# Altium schematic sheet LIDO-HW.200.MCU_SWD_Reset.SchDoc
size A3; SheetNumber: 12; SheetTotal: 17
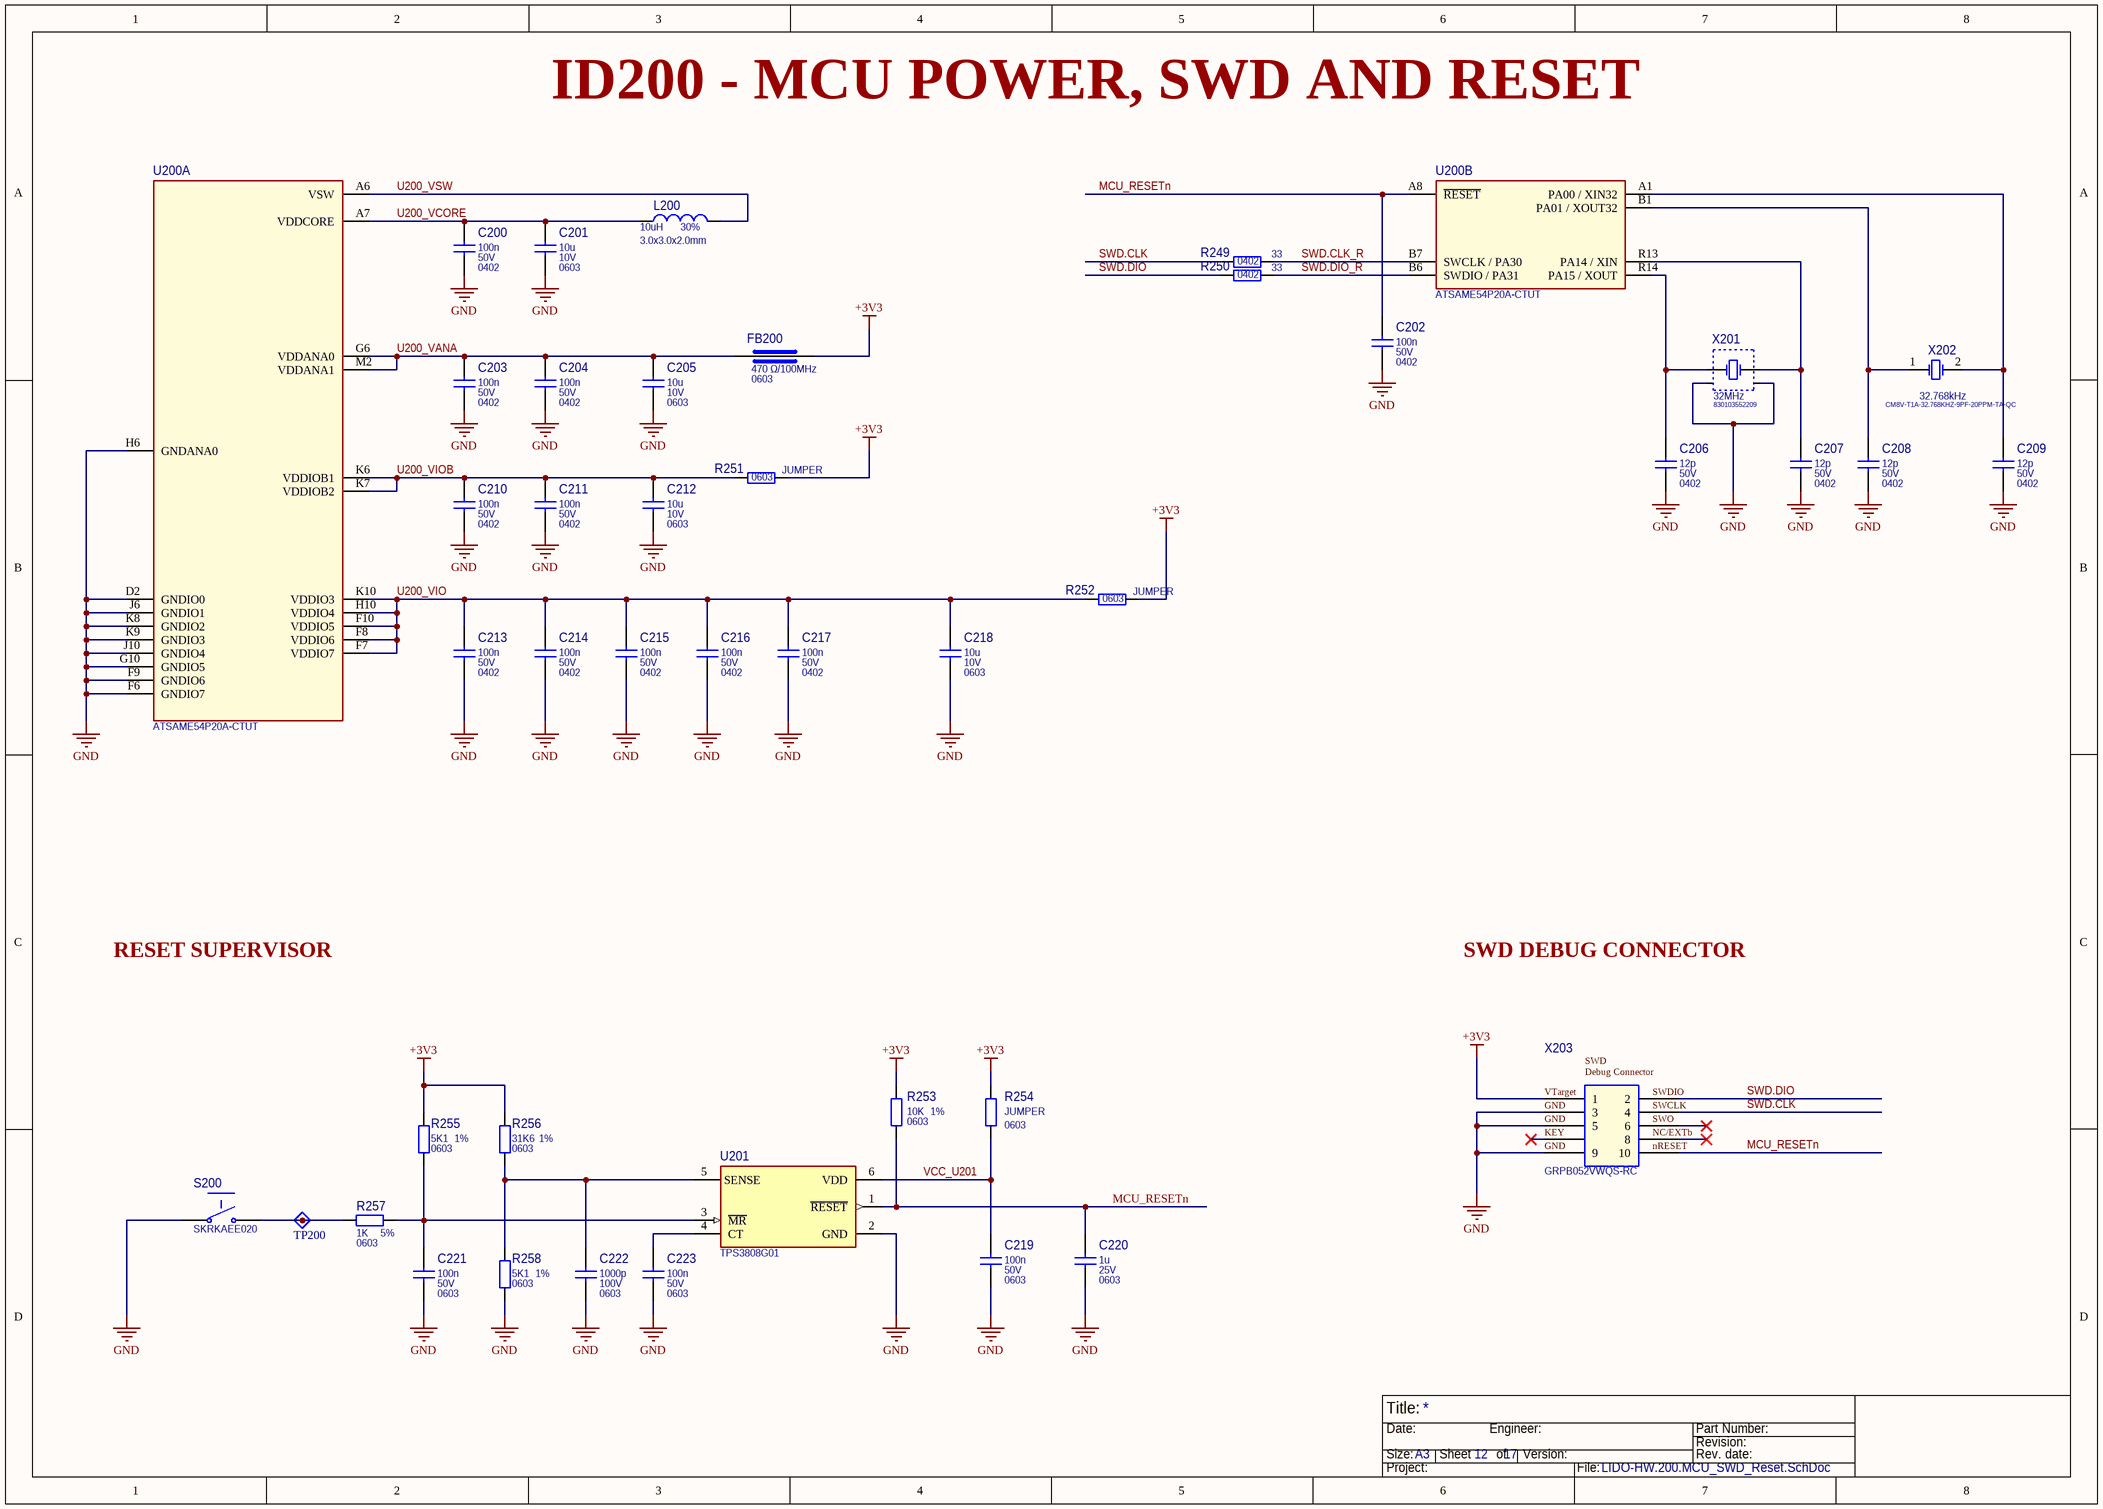
[diagram p0: LIDO-HW.200.MCU_SWD_Reset.SchDoc]

## Parts
C200  100n  Part Value 2: 50V  Part Package: 0402  [CAP_0402_1005X60-N_MURATA_A]
C201  10u  Part Value 2: 10V  Part Package: 0603  [CAP_0603_1608X90-N_MURATA_A]
C202  100n  Part Value 2: 50V  Part Package: 0402  [CAP_0402_1005X60-N_MURATA_A]
C203  100n  Part Value 2: 50V  Part Package: 0402  [CAP_0402_1005X60-N_MURATA_A]
C204  100n  Part Value 2: 50V  Part Package: 0402  [CAP_0402_1005X60-N_MURATA_A]
C205  10u  Part Value 2: 10V  Part Package: 0603  [CAP_0603_1608X90-N_MURATA_A]
C206  12p  Part Value 2: 50V  Part Package: 0402  [CAP_0402_1005X60-N_MURATA_A]
C207  12p  Part Value 2: 50V  Part Package: 0402  [CAP_0402_1005X60-N_MURATA_A]
C208  12p  Part Value 2: 50V  Part Package: 0402  [CAP_0402_1005X60-N_MURATA_A]
C209  12p  Part Value 2: 50V  Part Package: 0402  [CAP_0402_1005X60-N_MURATA_A]
C210  100n  Part Value 2: 50V  Part Package: 0402  [CAP_0402_1005X60-N_MURATA_A]
C211  100n  Part Value 2: 50V  Part Package: 0402  [CAP_0402_1005X60-N_MURATA_A]
C212  10u  Part Value 2: 10V  Part Package: 0603  [CAP_0603_1608X90-N_MURATA_A]
C213  100n  Part Value 2: 50V  Part Package: 0402  [CAP_0402_1005X60-N_MURATA_A]
C214  100n  Part Value 2: 50V  Part Package: 0402  [CAP_0402_1005X60-N_MURATA_A]
C215  100n  Part Value 2: 50V  Part Package: 0402  [CAP_0402_1005X60-N_MURATA_A]
C216  100n  Part Value 2: 50V  Part Package: 0402  [CAP_0402_1005X60-N_MURATA_A]
C217  100n  Part Value 2: 50V  Part Package: 0402  [CAP_0402_1005X60-N_MURATA_A]
C218  10u  Part Value 2: 10V  Part Package: 0603  [CAP_0603_1608X90-N_MURATA_A]
C219  100n  Part Value 2: 50V  Part Package: 0603  [CAP_0603_1608X90-N_MURATA_A]
C220  1u  Part Value 2: 25V  Part Package: 0603  [CAP_0603_1608X90-N_MURATA_A]
C221  100n  Part Value 2: 50V  Part Package: 0603  [CAP_0603_1608X90-N_MURATA_A]
C222  1000p  Part Value 2: 100V  Part Package: 0603  [CAP_0603_1608X90-N_MURATA_A]
C223  100n  Part Value 2: 50V  Part Package: 0603  [CAP_0603_1608X90-N_MURATA_A]
FB200  470 Ω/100MHz  Part Package: 0603  [IND_0603_1608X95-N_AVX_A]
L200  10uH  Part Value 2: 30%  Part Package: 3.0x3.0x2.0mm  [SUMIDA_CDRH2D18_HP_A]
R249  33  Part Package: 0402  [RES_0402_1005X40-N_YAGEO_A]
R250  33  Part Package: 0402  [RES_0402_1005X40-N_YAGEO_A]
R251  JUMPER  Part Package: 0603  [RES_0603_1608X60-N_YAGEO_A]
R252  JUMPER  Part Package: 0603  [RES_0603_1608X60-N_YAGEO_A]
R253  10K  Part Value 2: 1%  Part Package: 0603  [RES_0603_1608X60-N_YAGEO_A]
R254  JUMPER  Part Package: 0603  [RES_0603_1608X60-N_YAGEO_A]
R255  5K1  Part Value 2: 1%  Part Package: 0603  [RES_0603_1608X60-N_YAGEO_A]
R256  31K6  Part Value 2: 1%  Part Package: 0603  [RES_0603_1608X60-N_YAGEO_A]
R257  1K  Part Value 2: 5%  Part Package: 0603  [RES_0603_1608X60-N_YAGEO_A]
R258  5K1  Part Value 2: 1%  Part Package: 0603  [RES_0603_1608X60-N_YAGEO_A]
S200  SKRKAEE020  [ALPS_SKRKA_390X290X200_A]
TP200  TestPoint_A  [TESTPOINT_1D_A]  (value not drawn)  (no BOM)
U200  ATSAME54P20A-CTUT  [BGA120CP50_15X15_800X800X120B25-N_MICROCHIP_A]  (parts A,B of 4)
U201  TPS3808G01  [SOT23-6P95_280X145L45-N_TI_A]
X201  32MHz  Manufacturer Part Number: 830103552209  [IQD_CFPX180_340X270X80_A]
X202  32.768kHz  Manufacturer Part Number: CM8V-T1A-32.768KHZ-9PF-20PPM-TA-QC  [ECS_ECX-12Q_200x120x55_A]
X203  GRPB052VWQS-RC  [SAMTEC_FTSH-105-01-L-DV_A]

## Nets
+3V3: FB200.2 R251.2 R252.2 R253.2 R254.2 R255.2 R256.2 X203.1
GND: C200.2 C201.2 C202.2 C203.2 C204.2 C205.2 C206.2 C207.2 C208.2 C209.2 C210.2 C211.2 C212.2 C213.2 C214.2 C215.2 C216.2 C217.2 C218.2 C219.1 C220.2 C221.1 C222.2 C223.1 R258.1 S200.1 U200.D2(GNDIO0) U200.F6(GNDIO7) U200.F9(GNDIO6) U200.G10(GNDIO5) U200.H6(GNDANA0) U200.J6(GNDIO1) U200.J10(GNDIO4) U200.K8(GNDIO2) U200.K9(GNDIO3) U201.2(GND) X201.2(GND) X201.4(GND) X203.3 X203.5 X203.9
MCU_RESETn: C202.1 C220.1 R253.1 U200.A8(~{RESET}) U201.1(~{RESET}) X203.10
SWD.CLK: R249.1 X203.4
SWD.CLK_R: R249.2 U200.B7(SWCLK_/_PA30)
SWD.DIO: R250.1 X203.2
SWD.DIO_R: R250.2 U200.B6(SWDIO_/_PA31)
U200_VANA: C203.1 C204.1 C205.1 FB200.1 U200.G6(VDDANA0) U200.M2(VDDANA1)
U200_VCORE: C200.1 C201.1 L200.1 U200.A7(VDDCORE)
U200_VIO: C213.1 C214.1 C215.1 C216.1 C217.1 C218.1 R252.1 U200.F7(VDDIO7) U200.F8(VDDIO6) U200.F10(VDDIO5) U200.H10(VDDIO4) U200.K10(VDDIO3)
U200_VIOB: C210.1 C211.1 C212.1 R251.1 U200.K6(VDDIOB1) U200.K7(VDDIOB2)
U200_VSW: L200.2 U200.A6(VSW)
VCC_U201: C219.2 R254.1 U201.6(VDD)
NetC206_1: C206.1 U200.R14(PA15_/_XOUT) X201.1(OSC1)
NetC207_1: C207.1 U200.R13(PA14_/_XIN) X201.3(OSC2)
NetC208_1: C208.1 U200.B1(PA01_/_XOUT32) X202.1(OSC1)
NetC209_1: C209.1 U200.A1(PA00_/_XIN32) X202.2(OSC2)
NetC221_2: C221.2 R255.1 R257.1 U201.3(~{MR})
NetC222_1: C222.1 R256.1 R258.2 U201.5(SENSE)
NetC223_2: C223.2 U201.4(CT)
NetR257_2: R257.2 S200.2 TP200.1(TP)

Not connected (* = marked no-connect by the designer): X203 6* 7* 8*

## Notes on the sheet
- ID200 - MCU POWER, SWD AND RESET
- RESET SUPERVISOR
- SWD DEBUG CONNECTOR
- Title:
- Size:
- Date:
- A3
- Sheet       of
- Engineer:
- Version:
- Part Number:
- Revision:
- Rev. date:
- Project:
- File:
- (in symbol 52) SWD; Debug Connector; VTarget; SWDIO; GND; SWCLK; SWO; KEY; NC/EXTb; nRESET

## Library data of the parts
C200 C202-C204 C210 C211 C213-C217 = 93: CAP CER 0.1UF 50V X7R 0402; Manufacturer Part Number: GCM155R71H104KE02D; Manufacturer: Murata Electronics; Obsolete Part: False; Component ID: 93; Part Value: 100n; Part Value 3: X7R; Package Type: SMT
C201 C205 C212 C218 = 94: CAP CER 10UF 10V X7R 0603; Manufacturer Part Number: GRM188Z71A106KA73D; Manufacturer: Murata Electronics; Obsolete Part: False; Component ID: 94; Part Value: 10u; Part Value 3: X7R; Package Type: SMT
C206-C209 = 95: CAP CER 12PF 50V C0G/NP0 0402; Manufacturer Part Number: GJM1555C1H120FB01D; Manufacturer: Murata Electronics; Obsolete Part: False; Component ID: 95; Part Value: 12p; Part Value 3: C0G; Package Type: SMT
C219 C221 C223 = 77: CAP CER 0.1UF 50V X7R 0603; Manufacturer Part Number: CGA3E2X7R1H104K080AA; Manufacturer: TDK Corporation; Obsolete Part: False; Component ID: 77; Part Value: 100n; Part Value 3: X7R; Package Type: SMT
C220 = 78: CAP CER 1UF 25V X7R 0603; Manufacturer Part Number: CGA3E1X7R1E105M080AE; Manufacturer: TDK Corporation; Obsolete Part: False; Component ID: 78; Part Value: 1u; Part Value 3: X7R; Package Type: SMT
C222 = 84: CAP CER 1000PF 100V X7R 0603; Manufacturer Part Number: CGA3E2X7R2A102K080AA; Manufacturer: TDK Corporation; Obsolete Part: False; Component ID: 84; Part Value: 1000p; Part Value 3: X7R; Package Type: SMT
FB200 = 19: FERRITE BEAD 470 OHM 0603 1LN; Manufacturer Part Number: BLM18PG471SN1D; Manufacturer: Murata Electronics; Obsolete Part: False; Component ID: 19; Part Type: Ferrite Beads; Part Value: 470 Ω/100MHz; Part Value 2: 1A; Package Type: SMT
L200 = 26: FIXED IND 10UH 900MA 245MOHM SMD; Manufacturer Part Number: CDRH2D18/HPNP-100NC; Manufacturer: Sumida America Components Inc.; Obsolete Part: False; Component ID: 26; Part Value: 10uH; Part Value 3: 900mA; Package Type: SMT
R249 R250 = 111: RES SMD 33 OHM 5% 1/10W 0402; Manufacturer Part Number: ERJ-2GEJ330X; Manufacturer: Panasonic Electronic Components; Obsolete Part: False; Component ID: 111; Part Value: 33; Part Value 2: 5%; Part Value 3: 1/10W; Package Type: SMT
R251 R252 R254 = 9: RES 0 OHM JUMPER 1/10W 0603; Manufacturer Part Number: RC0603JR-070RL; Manufacturer: YAGEO; Manufacturer Part Number 2nd: RMCF0603ZT0R00; Manufacturer 2nd: Stackpole Electronics Inc; Obsolete Part: False; Component ID: 9; Part Value: JUMPER; Part Value 2: 5%; Part Value 3: 1/10W; Package Type: SMT
R253 = 115: RES 10K OHM 1% 1/10W 0603; Manufacturer Part Number: RC0603FR-0710KL; Manufacturer: YAGEO; Obsolete Part: False; Component ID: 115; Part Value: 10K; Part Value 3: 1/10W; Package Type: SMT
R255 R258 = 122: RES SMD 5.1K OHM 1% 1/10W 0603; Manufacturer Part Number: ERJ-3EKF5101V; Manufacturer: Panasonic Electronic Components; Obsolete Part: False; Component ID: 122; Part Value: 5K1; Part Value 3: 1/10W; Package Type: SMT
R256 = 123: RES 31.6K OHM 1% 1/10W 0603; Manufacturer Part Number: RC0603FR-0731K6L; Manufacturer: YAGEO; Obsolete Part: False; Component ID: 123; Part Value: 31K6; Part Value 3: 1/10W; Package Type: SMT
R257 = 113: RES 1K OHM 5% 1/10W 0603; Manufacturer Part Number: RC0603JR-071KL; Manufacturer: YAGEO; Obsolete Part: False; Component ID: 113; Part Value: 1K; Part Value 3: 1/10W; Package Type: SMT
S200 = 4: Switch Tactile N.O. SPST Round Button Gull Wing 0.05A 12VDC 1.57N SMD T/R; Manufacturer: Alps Alpine; Obsolete Part: False; Component ID: 4; Manufacturer Part Number: SKRKAEE020; Part Type: Push-Button; Package Type: SMT
TP200 = 3: Pad Diamater 1mm; Part: Test Point 1D A; Obsolete Part: False; 00_Name: TP_XXmm; Component ID: 3; 02_Layer: *; 01_Diameter: 1mm
U200 = 10: ARM® Cortex®-M4F series Microcontroller IC 32-Bit Single-Core 120MHz 1MB (1M x 8) FLASH 120-TFBGA (8x8); Manufacturer: Microchip Technology; Part Package: TFBGA-120; Obsolete Part: False; Component ID: 10; Manufacturer Part Number: ATSAME54P20A-CTUT; Part Type: MCU M4; Package Type: SMT
U201 = 36: Supervisor Open Drain or Open Collector 1 Channel SOT-23-6; Manufacturer: Texas Instruments; Manufacturer Part Number: TPS3808G01DBVR; Part Package: SOT23-6; Obsolete Part: False; Designer: Matt Drazenovich; Ratings: RoHS; Reviewed: Dekimo_30-06-2020; Component ID: 36; Case/Package: SOT-23-6; ComponentType: IC; Design Date: 04-11-2019; Max Operating Temperature: 125°C; Min Operating Temperature: -40°C; Value: TPS3808G01; Part Type: Supervisor; Package Type: SMT
X201 = 18: 32 MHz ±10ppm Crystal 9pF 40 Ohms 4-SMD, No Lead; Manufacturer: Würth Elektronik; Part Package: SMD-4; Obsolete Part: False; Component ID: 18; Part Value: 32MHz; Package Type: SMT
X202 = 17: 32.768 kHz ±20ppm Crystal 9pF 70 kOhms 2-SMD, No Lead; Manufacturer: Micro Crystal AG; Part Package: SMD-2; Obsolete Part: False; Component ID: 17; Part Value: 32.768kHz; Package Type: SMT
X203 = 52: CONN HEADER SMD 10POS 1.27MM; Manufacturer: Sullins Connector Solutions; Part Value: 10-Pins; Obsolete Part: False; Component ID: 52; Manufacturer Part Number: GRPB052VWQS-RC; Part Type: SWD  CONN; Part Pitch: 1.27mm